# EAGLE design booster003 (EAGLE 4.16)
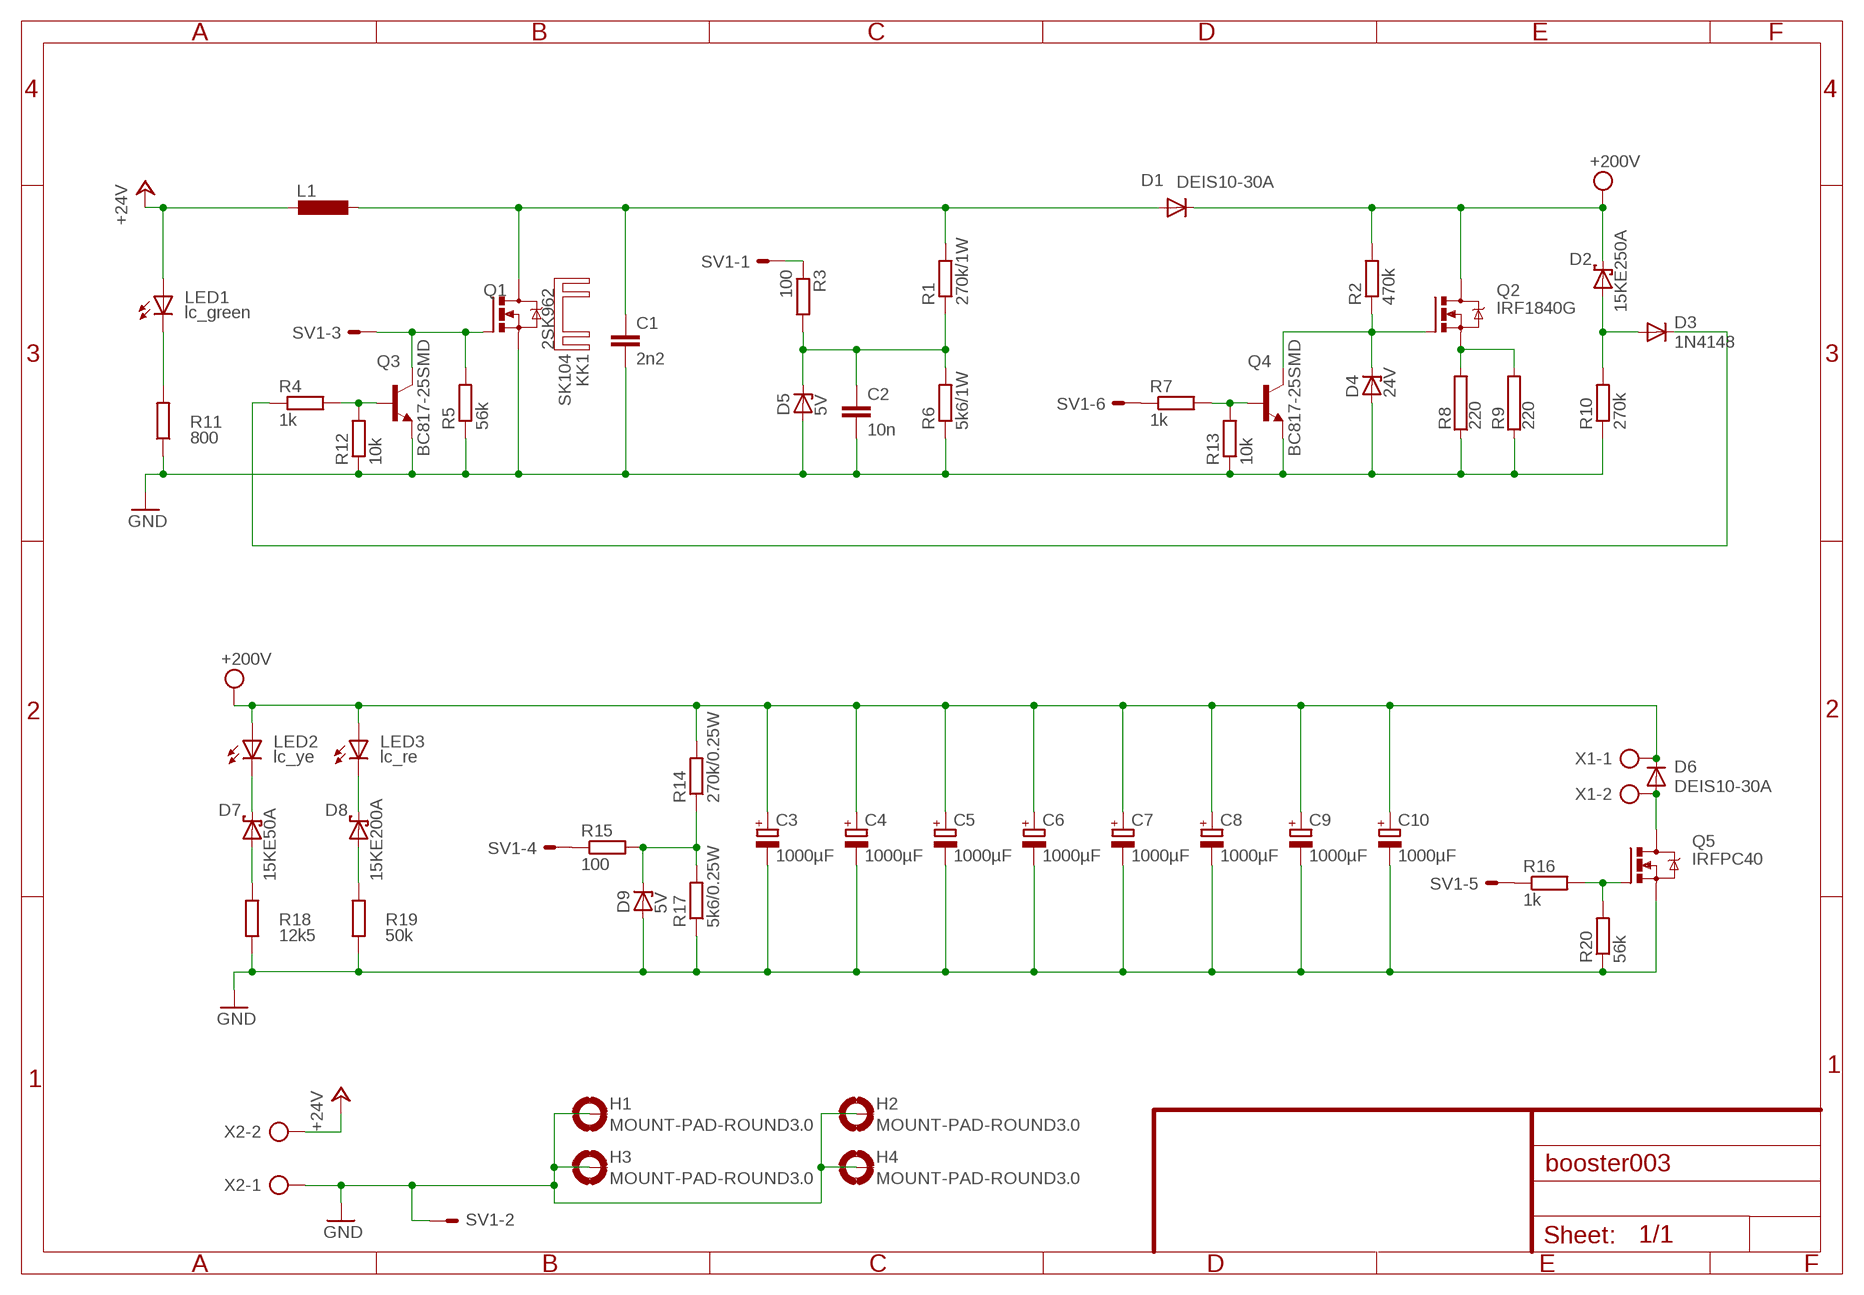
[diagram p0: schematic, sheet 1]

## Parts
C1  2n2  C-EU150-054X183  [C150-054X183]
C2  10n  C-EUC0603  [C0603]
C3  1000µF  CPOL-EUE10-35  [EB35D]
C4  1000µF  CPOL-EUE10-35  [EB35D]
C5  1000µF  CPOL-EUE10-35  [EB35D]
C6  1000µF  CPOL-EUE10-35  [EB35D]
C7  1000µF  CPOL-EUE10-35  [EB35D]
C8  1000µF  CPOL-EUE10-35  [EB35D]
C9  1000µF  CPOL-EUE10-35  [EB35D]
C10  1000µF  CPOL-EUE10-35  [EB35D]
D1  DEIS10-30A  [TO247AD]
D2  15KE250A  15KEXX  [CB429-17]
D3  1N4148  [DO35-10]
D4  24V  ZENER-DIODESOT23  [SOT23]
D5  5V  ZENER-DIODESOT23  [SOT23]
D6  DEIS10-30A  [TO247AD]
D7  15KE50A  15KEXX  [CB429-17]
D8  15KE200A  15KEXX  [CB429-17]
D9  5V  ZENER-DIODESOT23  [SOT23]
H1  MOUNT-PAD-ROUND3.0  [3,0-PAD]
H2  MOUNT-PAD-ROUND3.0  [3,0-PAD]
H3  MOUNT-PAD-ROUND3.0  [3,0-PAD]
H4  MOUNT-PAD-ROUND3.0  [3,0-PAD]
KK1  SK104  [SK104]
L1  L-EUTJ6-U1  [TJ6-U1]
LED1  lc_green  LED5MM  [LED5MM]
LED2  lc_ye  LED5MM  [LED5MM]
LED3  lc_re  LED5MM  [LED5MM]
Q1  2SK962  IRFPC40  [TO247BV]
Q2  IRF1840G  IRF740  [TO220BV]
Q3  BC817-25SMD  [SOT23-BEC]
Q4  BC817-25SMD  [SOT23-BEC]
Q5  IRFPC40  [TO247BV]
R1  270k/1W  R-EU_0207/10  [0207/10]
R2  470k  R-EU_R0805  [R0805]
R3  100  R-EU_R0805  [R0805]
R4  1k  R-EU_R0805  [R0805]
R5  56k  R-EU_R0805  [R0805]
R6  5k6/1W  R-EU_0207/10  [0207/10]
R7  1k  R-EU_R0805  [R0805]
R8  220  RHS25  [HS25]
R9  220  RHS25  [HS25]
R10  270k  R-EU_R0805  [R0805]
R11  800  R-EU_R0805  [R0805]
R12  10k  R-EU_R0805  [R0805]
R13  10k  R-EU_R0805  [R0805]
R14  270k/0.25W  R-EU_0207/10  [0207/10]
R15  100  R-EU_R0805  [R0805]
R16  1k  R-EU_R0805  [R0805]
R17  5k6/0.25W  R-EU_0207/10  [0207/10]
R18  12k5  R-EU_R0805  [R0805]
R19  50k  R-EU_R0805  [R0805]
R20  56k  R-EU_R0805  [R0805]
SV1  ML6LE  [ML6L]
X1  AK500/2-H  [AK500/2-H]
X2  AK500/2-H  [AK500/2-H]

## Nets
+24V: L1.2 LED1.A X2.2
ADC_250V: C2.1 D5.3(C) R1.1 R3.2 R6.2
ADC_250V1: D9.3(C) R14.1 R15.2 R17.2
GND [Power]: C1.2 C2.2 C3.- C4.- C5.- C6.- C7.- C8.- C9.- C10.- D4.1(A) D5.1(A) D9.1(A) H1.B3,0(MOUNT) H2.B3,0(MOUNT) H3.B3,0(MOUNT) H4.B3,0(MOUNT) Q1.S Q3.E Q4.E Q5.S R5.1 R6.1 R8.1 R9.1 R10.1 R11.1 R12.1 R13.1 R17.1 R18.1 R19.1 R20.1 SV1.2 X2.1
N$1: D2.A D3.A R10.2
N$2: Q5.G R16.2 R20.2
N$3: D7.A R18.2
N$4: D3.C R4.1
N$5 [Power]: D6.A Q5.D X1.2
N$6: D7.C LED2.K(C)
N$7: LED1.K(C) R11.2
N$12: D8.A R19.2
N$13: D8.C LED3.K(C)
N$16: R3.1 SV1.1
N$17: R15.1 SV1.4
N$18: D4.3(C) Q2.G Q4.C R2.1
N$19: Q2.S R8.2 R9.2
N$21: Q4.B R7.2 R13.2
N$22: R16.1 SV1.5
N$23: Q3.B R4.2 R12.2
N$24: R7.1 SV1.6
N$29: Q1.G Q3.C R5.2 SV1.3
N$32 [Power]: C1.1 D1.A L1.1 Q1.D R1.2
VPP: C3.+ C4.+ C5.+ C6.+ C7.+ C8.+ C9.+ C10.+ D1.K(C) D2.C D6.K(C) LED2.A LED3.A Q2.D R2.2 R14.2 X1.1 ; supply symbol labelled +200V

## Library data of the parts
C1 C2 = rcl:C-EU: CAPACITOR, European symbol
C3-C10 = rcl:CPOL-EU: POLARIZED CAPACITOR, European symbol
D1 D6 = carpenoctem:DEIS10-30A
D2 D7 D8 = diode:15KEXX: DIODE
D3 = diode:1N4148: DIODE high speed (Philips)
D4 D5 D9 = diode:ZENER-DIODE: Z-Diode
H1-H4 = holes:MOUNT-PAD-ROUND: MOUNTING PAD, round
KK1 = heatsink:SK104: HEATSINK manufacturer Fischer/distributor Buerklin
L1 = rcl:L-EU: INDUCTOR, European symbol
LED1-LED3 = led:LED: LED OSRAM: - CHIPLED LG R971, LG N971, LY N971, LG Q971, LY Q971, LO R971, LY R971 LH N974, LH R974 LS Q976, LO Q976, LY Q976 LO Q996 - Hyper CHIPLED LW Q18S LB Q993, LB Q99A, LB R99A - SideLED LS A670, LO A670, LY A670, LG A670, LP A670 LB A673, LV A673, LT A673, LW A673 LH A674 LY A675 LS A676, LA A676, LO A676, LY A676, LW A676 LS A679, LY A679, LG A679 - Hyper Micro SIDELED® LS Y876, LA Y876, LO Y876, LY Y876 LT Y87S - SmartLED LW L88C, LW L88S LB L89C, LB L89S, LG L890 LS L89K, LO L89K, LY L89K LS L896, LA L896, LO L896, LY L896 - TOPLED LS T670, LO T670, LY T670, LG T670, LP T670 LSG T670, LSP T670, LSY T670, LOP T670, LYG T670 LG T671, LOG T671, LSG T671 LB T673, LV T673, LT T673, LW T673 LH T674 LS T676, LA T676, LO T676, LY T676, LB T676, LH T676, LSB T676, LW T676 LB T67C, LV T67C, LT T67C, LS T67K, LO T67K, LY T67K, LW E67C LS E67B, LA E67B, LO E67B, LY E67B, LB E67C, LV E67C, LT E67C LW T67C LS T679, LY T679, LG T679 LS T770, LO T770, LY T770, LG T770, LP T770 LB T773, LV T773, LT T773, LW T773 LH T774 LS E675, LA E675, LY E675, LS T675 LS T776, LA T776, LO T776, LY T776, LB T776 LHGB T686 LT T68C, LB T68C - Hyper Mini TOPLED® LB M676 - Mini TOPLED Santana® LG M470 LS M47K, LO M47K, LY M47K Source: http://www.osram.convergy.de - LUMILED® LXK2-PW12-R00, LXK2-PW12-S00, LXK2-PW14-U00, LXK2-PW14-V00 LXK2-PM12-R00, LXK2-PM12-S00, LXK2-PM14-U00 LXK2-PE12-Q00, LXK2-PE12-R00, LXK2-PE12-S00, LXK2-PE14-T00, LXK2-PE14-U00 LXK2-PB12-K00, LXK2-PB12-L00, LXK2-PB12-M00, LXK2-PB14-N00, LXK2-PB14-P00, LXK2-PB14-Q00 LXK2-PR12-L00, LXK2-PR12-M00, LXK2-PR14-Q00, LXK2-PR14-R00 LXK2-PD12-Q00, LXK2-PD12-R00, LXK2-PD12-S00 LXK2-PH12-R00, LXK2-PH12-S00 LXK2-PL12-P00, LXK2-PL12-Q00, LXK2-PL12-R00 Source: www.luxeon.com
Q1 Q5 = transistor-power:IRFPC40: N-CHANNEL MOS FET
Q2 = transistor-power:IRF740: N-CHANNEL MOS FET
Q3 Q4 = transistor-npn:BC817*: NPN Transistor
R1-R7 R10-R20 = rcl:R-EU_: RESISTOR, European symbol
R8 R9 = resistor-power:R: Power Resitor
SV1 = con-harting-ml:ML6?E: HARTING
X1 X2 = con-ptr500:AK500/2-H: CONNECTOR Aug. 2004 / PTR Meßtechnik: Die Bezeichnung der Serie AK505 wurde geändert. Es handelt sich hierbei um AK500 in horizontaler Ausführung.

## Net classes
1 Power: width 0.406 mm
2 High Power: width 2 mm

## Board
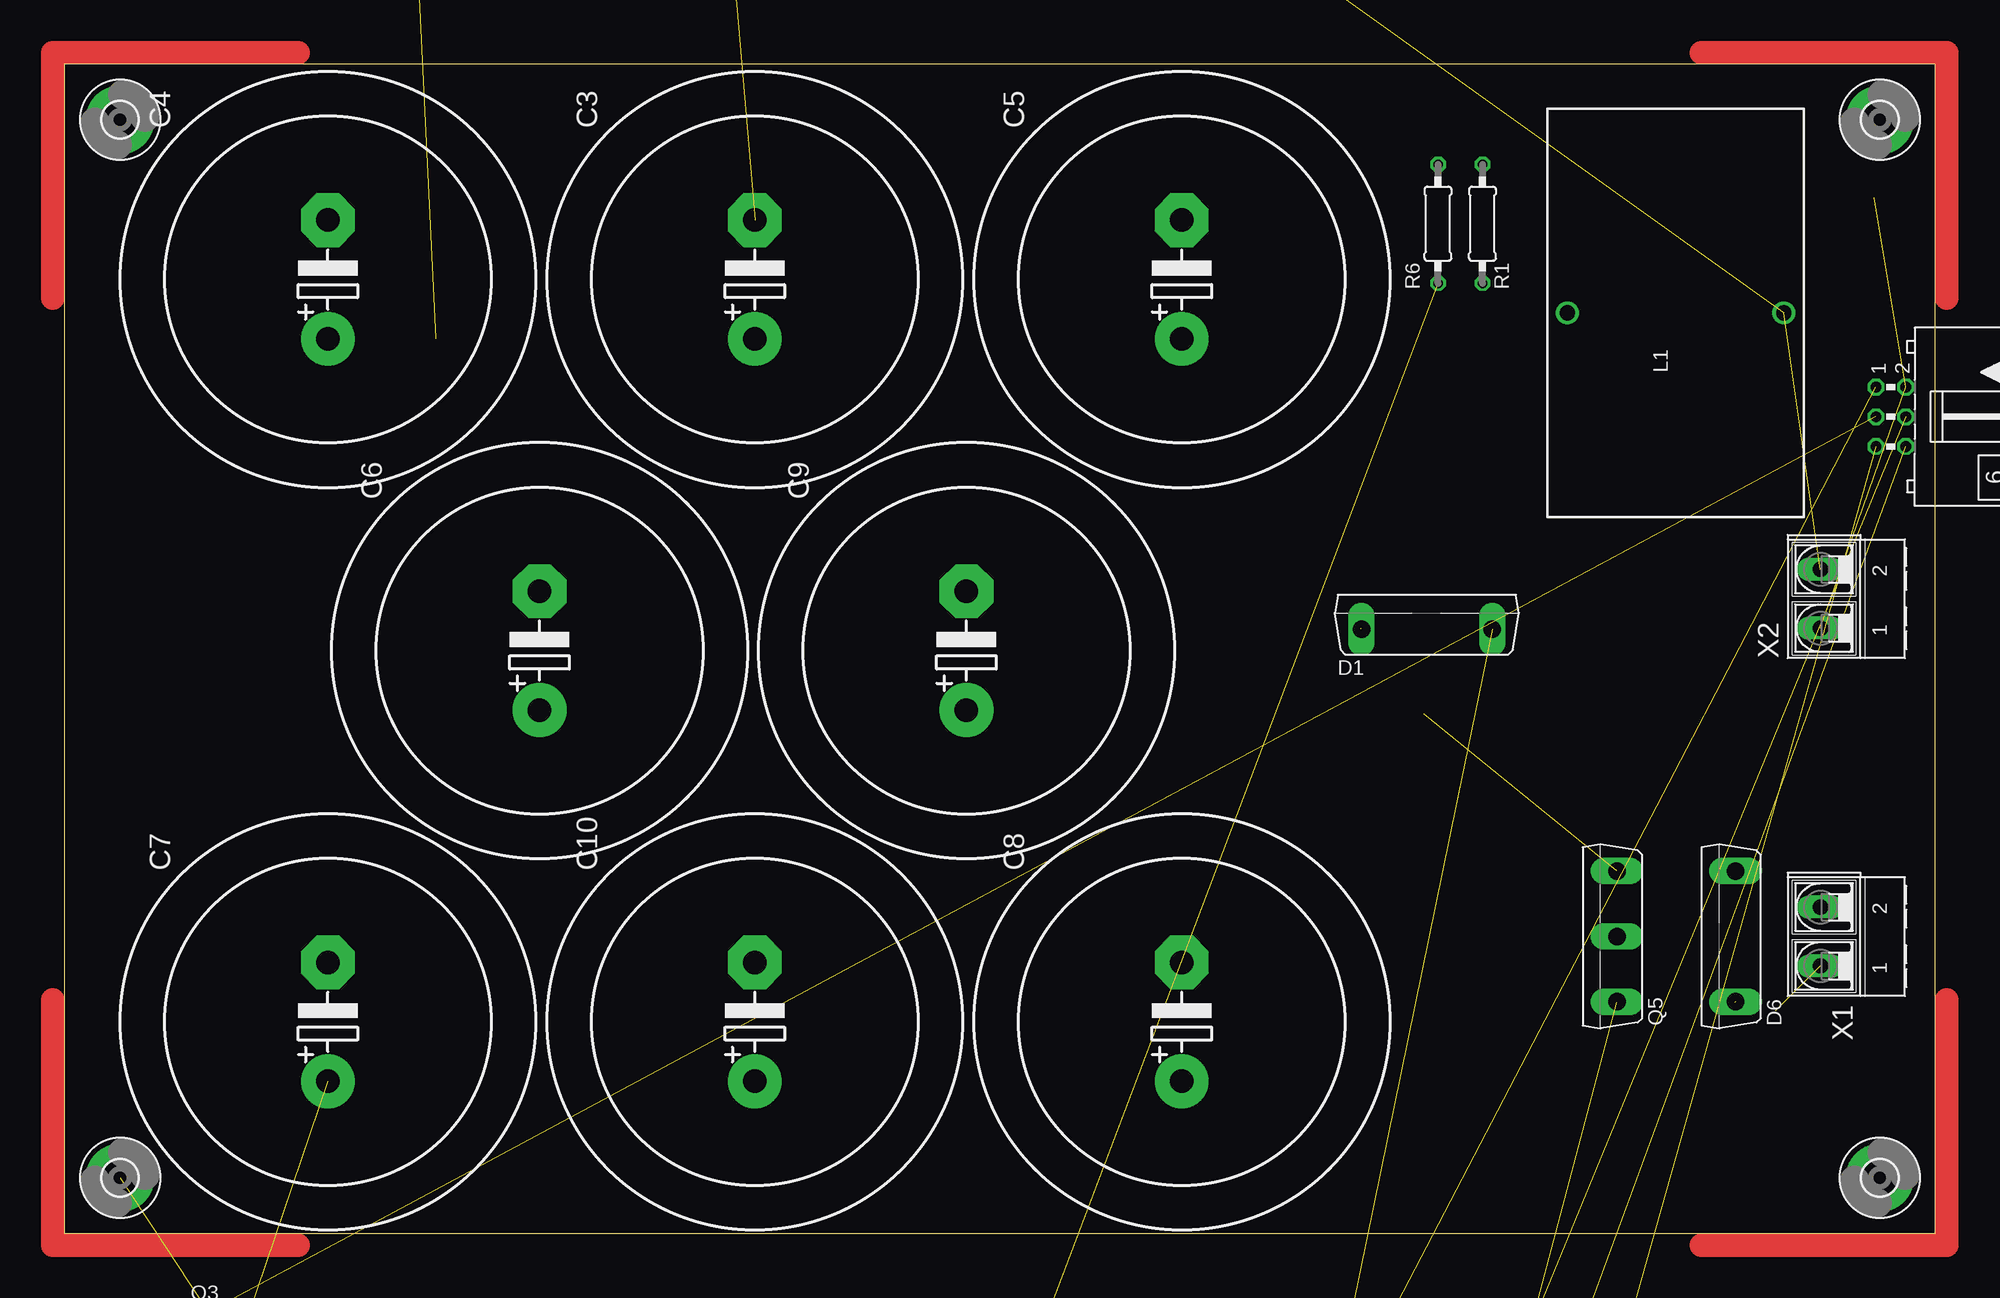
[diagram p1: board, top side]
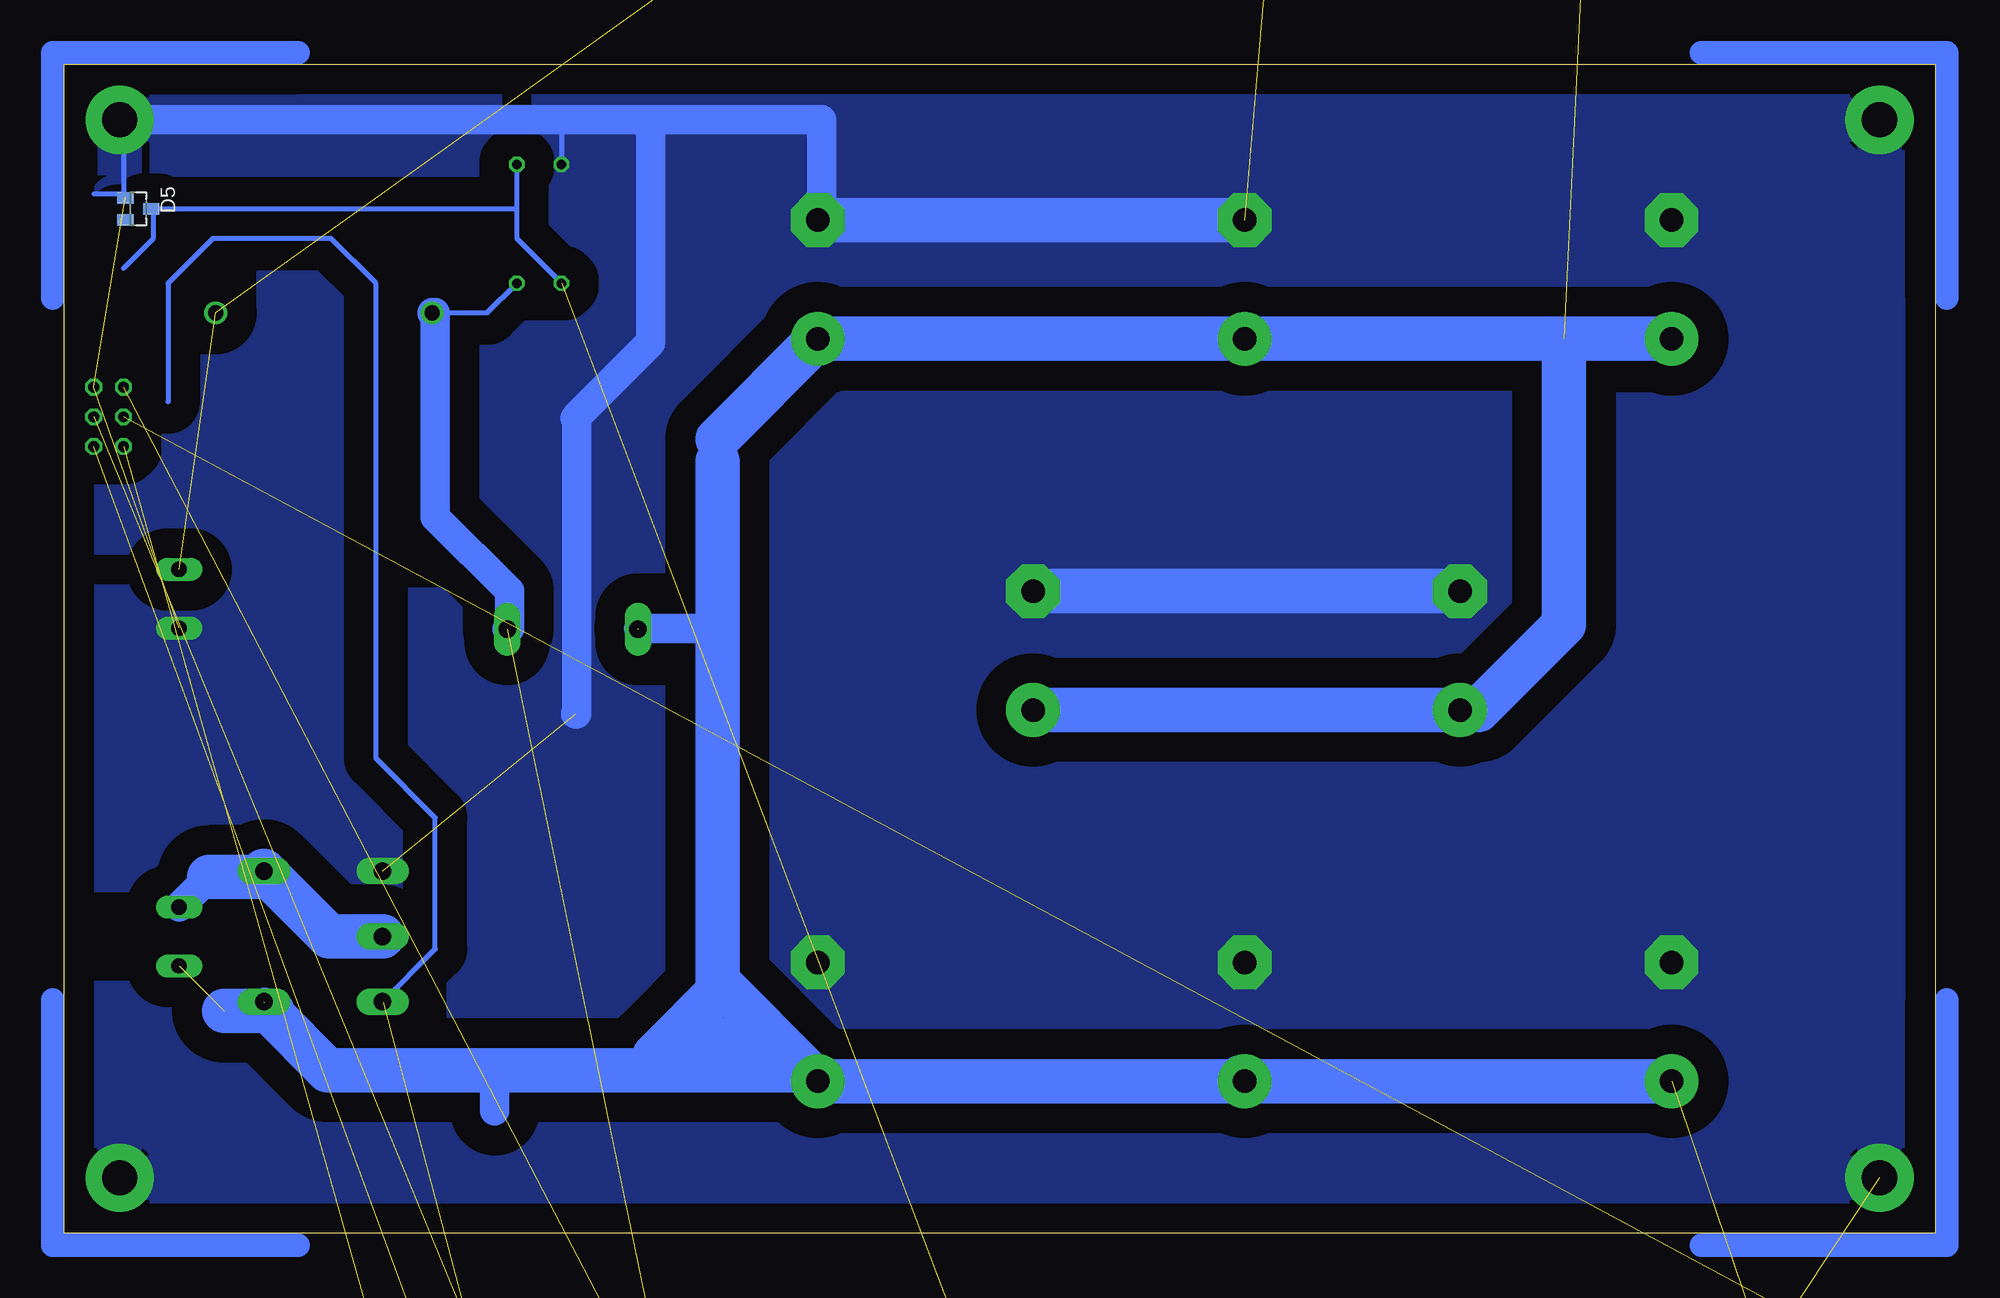
[diagram p2: board, bottom side, seen from below]

Size 160 x 100 mm. Coordinates in mm from the lower left corner, seen from the top.
Outline: 0,0 160,0 160,100 0,100 0,0
Copper layers (1*16): Top 0.035mm / dielectric 1.5mm / Bottom 0.035mm
Design rules "olimex_10mils": minimum track width 10mil, minimum drill 24mil, track to track 10mil, track to pad 10mil, pad to pad 10mil, via to via 10mil, smd to smd 10mil, copper to edge 40mil, drill to drill 10mil, minimum pad ring 10mil, minimum via ring 8mil, stop-mask expansion 0mil, vias tented up to drill 0mil, thermal gap 10mil

### Footprints (pad centres in the part's own frame; a part is rotated, then mirrored left to right if it is on the bottom)
C150-054X183 = drill 1.016 octagon: 1 -7.493,0; 2 7.493,0
C0603 = smd 1.1 x 1: 1 -0.85,0; 2 0.85,0
EB35D = drill 2.007 pad 4.597 round: + -5.08,0 | drill 2.007 pad 4.597 octagon: - 5.08,0
TO247AD = drill 1.499 long: A 5.588,-0.381; K -5.588,-0.381
CB429-17 = drill 1.397 long: A 8.89,0; C -8.89,0
DO35-10 = drill 0.813 long: A 5.08,0; C -5.08,0
SOT23 = smd 1 x 1.4: 1 -0.95,-1.1; 2 0.95,-1.1; 3 0,1.1
3,0-PAD = drill 3 pad 5.842 round: B3,0 0,0
SK104 = drill 2.54 pad 5.08 round: A2,5 -12.7,-0.762; B2,5 12.7,-0.762
TJ6-U1 = drill 1.3 round: 1 -9.25,0; 2 9.25,0
LED5MM = drill 0.813 octagon: A -1.27,0; K 1.27,0
TO247BV = drill 1.499 long: D 0,-2.921; G -5.588,-2.921; S 5.588,-2.921
TO220BV = drill 1.016 long: D 0,-2.54; G -2.54,-2.54; S 2.54,-2.54
SOT23-BEC = smd 1 x 1.4: B -0.95,-1.1; C 0,1.1; E 0.95,-1.1
0207/10 = drill 0.813 octagon: 1 -5.08,0; 2 5.08,0
R0805 = smd 1.3 x 1.5: 1 -0.85,0; 2 0.85,0
HS25 = drill 1.3 octagon: 1 -20.47,0; 2 20.47,0 | hole 3.2: 9.15,9.9; -9.15,-9.9
ML6L = drill 0.914 octagon: 1 -2.54,-1.27; 2 -2.54,1.27; 3 0,-1.27; 4 0,1.27; 5 2.54,-1.27; 6 2.54,1.27
AK500/2-H = drill 1.321 long: 1 -2.515,0; 2 2.515,0

### Placement (x,y rotation side)
C1  8.89,-519.43 0 top  (outside the outline)
C2  1.27,-231.14 0 top  (outside the outline)
C3  59.05,81.6 90 top
C4  22.54,81.6 90 top
C5  95.57,81.6 90 top
C6  40.64,49.85 90 top
C7  22.54,18.1 90 top
C8  95.57,18.1 90 top
C9  77.15,49.85 90 top
C10  59.05,18.1 90 top
D1  116.52,52.07 0 top
D2  10.16,-49.53 0 top  (outside the outline)
D3  6.35,-510.54 0 top  (outside the outline)
D4  1.27,-274.32 0 top  (outside the outline)
D5  153.67,87.63 270 bottom
D6  142.56,25.4 90 top
D7  36.83,139.7 0 top  (outside the outline)
D8  36.83,148.59 0 top  (outside the outline)
D9  39.37,-238.76 0 top  (outside the outline)
H1  4.76,95.25 0 top
H2  155.26,95.25 0 top
H3  4.76,4.76 0 top
H4  155.26,4.76 0 top
KK1  15.24,-394.97 0 top  (outside the outline)
L1  137.79,78.74 0 top
LED1  24.13,167.64 0 top  (outside the outline)
LED2  30.48,129.54 0 top  (outside the outline)
LED3  49.53,129.54 0 top  (outside the outline)
Q1  10.16,-488.95 0 top  (outside the outline)
Q2  3.81,-403.86 0 top  (outside the outline)
Q3  12.7,-7.62 0 top  (outside the outline)
Q4  1.27,-344.17 0 top  (outside the outline)
Q5  129.86,25.4 90 top
R1  121.28,86.36 270 top
R2  1.27,-283.21 0 top  (outside the outline)
R3  1.27,-223.52 0 top  (outside the outline)
R4  12.7,-16.51 0 top  (outside the outline)
R5  1.27,-415.29 0 top  (outside the outline)
R6  117.47,86.36 270 top
R7  1.27,-360.68 0 top  (outside the outline)
R8  33.02,-316.23 0 top  (outside the outline)
R9  22.86,-538.48 0 top  (outside the outline)
R10  1.27,-375.92 0 top  (outside the outline)
R11  20.32,177.8 0 top  (outside the outline)
R12  1.27,-502.92 0 top  (outside the outline)
R13  1.27,-368.3 0 top  (outside the outline)
R14  24.13,-257.81 0 top  (outside the outline)
R15  20.32,-265.43 0 top  (outside the outline)
R16  1.27,-481.33 0 top  (outside the outline)
R17  41.91,-257.81 0 top  (outside the outline)
R18  54.61,148.59 0 top  (outside the outline)
R19  27.94,157.48 0 top  (outside the outline)
R20  1.27,-473.71 0 top  (outside the outline)
SV1  156.21,69.85 270 top
X1  150.18,25.4 90 top
X2  150.18,54.29 90 top

### Tracks (layer width: path | path; a pad name or v marks a point on that pad's centre or on a via)
+24V  (2 unrouted)
ADC_250V  (2 unrouted)
  Bottom 0.406: D5.3 152.4,87.46 | 152.4,87.63 152.72,87.31 | D5.3 152.72,87.63 | R6.2 121.28,85.09 121.28,87.63 | 121.28,87.63 R1.1 | 121.28,87.63 152.4,87.63 | 154.94,82.55 152.4,85.09 152.4,87.63 | 152.4,87.63 D5.3
ADC_250V1  (3 unrouted)
GND  (21 unrouted)
  Bottom 0.406: 154.94,95.25 154.94,88.9 | 154.94,88.9 154.94,88.75 D5.1 | 154.94,88.9 157.48,88.9 | 117.47,95.25 R6.1
  Bottom 2.54: 95.25,86.36 95.25,86.68 95.25,95.25 109.86,95.25 | 109.86,95.25 117.47,95.25 154.94,95.25 | 109.86,95.25 109.86,76.2 116.33,69.72 116.2,69.6 116.2,44.45 116.27,44.45 | C5.- 95.89,86.68 95.89,86.36 | C9.- 76.83,54.61
  Bottom 3.81: C3.- C5.- | C6.- C9.-
  pour Bottom (isolate 2.54): -1.27,100.33 161.29,100.33 161.29,-1.27 -1.27,-1.27
N$1  (2 unrouted)
N$2  (2 unrouted)
  Bottom 0.406: 132.72,19.75 Q5.G 128.27,24.32 128.27,35.56 133.35,40.64 133.35,81.28 137.16,85.09 147.32,85.09 151.13,81.28 151.13,71.12
N$3  (1 unrouted)
N$4  (1 unrouted)
N$5
  Bottom 2.54: 147.61,30.48 X1.2 | 142.24,30.48 143.51,30.48 143.45,30.48 D6.A
  Bottom 3.81: 143.51,30.48 147.61,30.48 | D6.A 137.35,25.4 Q5.D
N$6  (1 unrouted)
N$7  (1 unrouted)
N$12  (1 unrouted)
N$13  (1 unrouted)
N$16  (1 unrouted)
N$17  (1 unrouted)
N$18  (3 unrouted)
N$19  (2 unrouted)
N$21  (2 unrouted)
N$22  (1 unrouted)
N$23  (2 unrouted)
N$24  (1 unrouted)
N$29  (3 unrouted)
N$32  (2 unrouted)
  Bottom 0.406: R1.2 123.83,78.74 128.27,78.74
  Bottom 2.54: 128.27,78.42 128.27,77.34 | 128.27,78.42 128.27,78.74 L1.1 128.54,78.7 128.27,78.42 | 128.27,78.42 128.27,61.28 121.92,54.93 121.92,51.75 122.05,51.75 D1.A
S$1
  Top 2: 20,-1 -1,-1 -1,20
S$2
  Top 2: 140,-1 161,-1 161,20
S$3
  Top 2: 20,101 -1,101 -1,80
S$4
  Top 2: 161,80 161,101 140,101
S$5
  Bottom 2: 20,-1 -1,-1 -1,20
S$6
  Bottom 2: 140,-1 161,-1 161,20
S$7
  Bottom 2: 20,101 -1,101 -1,80
S$8
  Bottom 2: 161,80 161,101 140,101
VPP  (9 unrouted)
  Bottom 2.54: 142.88,19.75 142.88,19.68 143.06,19.68 143.19,19.68 142.4,18.89 142.24,19.05 | 59.69,76.52 C3.+ 59.05,76.83 | 59.69,76.52 59.69,76.83 | 59.69,76.52 59.69,76.2 | 39.05,44.77 C6.+ 40.64,44.45 40.96,44.77 | 58.74,13.02 58.42,13.02 58.42,12.7 58.74,13.02 | 58.74,13.02 59.69,13.97 59.69,12.7 | 103.66,21.11 104.14,21.59 | 104.14,67.94 104.14,66.04 104.14,66.17 | C5.+ 95.89,76.2 | 58.74,13.02 C10.+ | 104.14,51.75 110.87,51.75 | 142.24,19.05 | 103.66,21.11 103.5,21.27 | 103.66,21.11 | 123.19,13.97 123.19,10.48
  Bottom 3.81: 31.75,76.52 C4.+ | 31.75,76.52 C3.+ C5.+ 104.14,67.94 | 39.05,44.77 31.75,52.07 31.75,76.52 | 40.96,44.77 C9.+ | C7.+ 58.42,13.02 | C10.+ C8.+ 96.52,13.97 | 96.52,13.97 103.66,21.11 109.54,15.24 | 104.14,21.59 104.14,51.75 104.14,66.04 | 142.24,19.05 146.34,19.05 | 96.52,13.97 107.95,13.97 | 107.95,13.97 109.22,15.24 | 100.33,16.51 105.41,16.51 107.95,13.97 | 142.4,18.89 137.48,13.97 123.19,13.97 107.95,13.97